# Altium schematic sheet TH2.SchDoc
size Letter; SheetNumber: 3; SheetTotal: 6
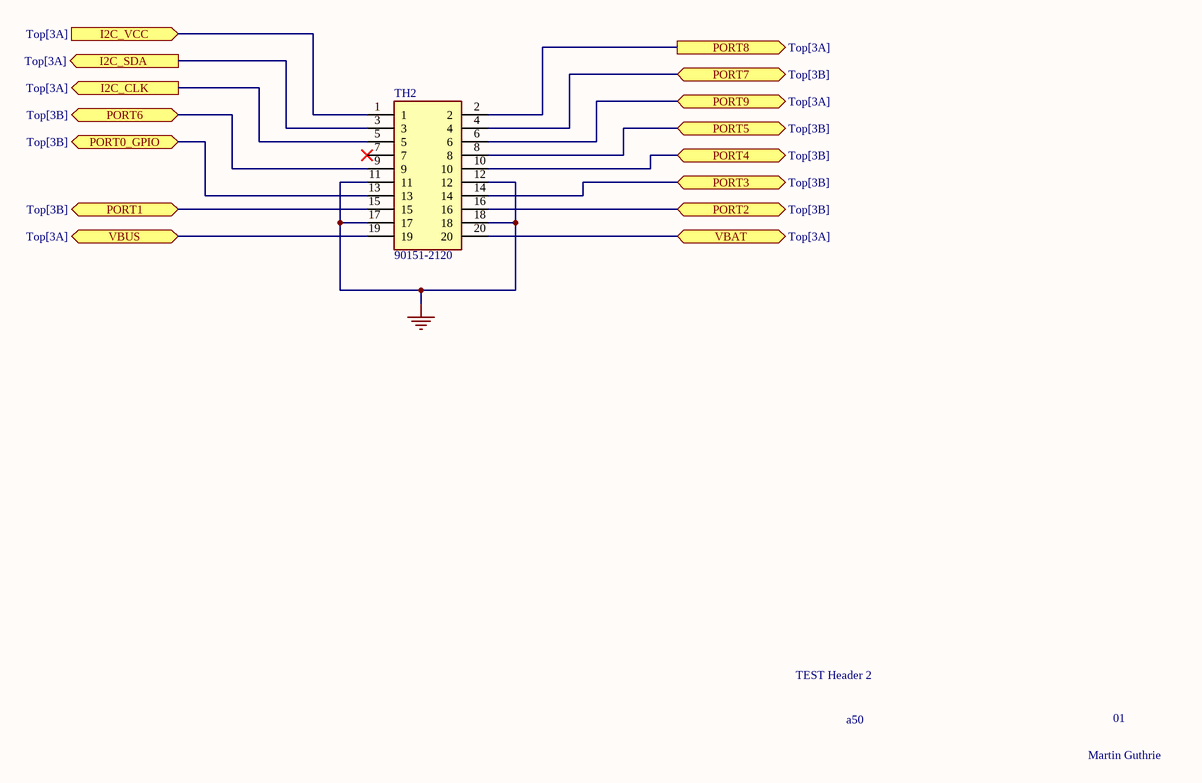
[diagram p0: TH2.SchDoc]

## Parts
TH2  90151-2120  [90151-2120]

## Ports
I2C_CLK (out, see Top[3A]), I2C_SDA (out, see Top[3A]), I2C_VCC (in, see Top[3A]), PORT0_GPIO (bidir, see Top[3B]), PORT1 (bidir, see Top[3B]), PORT2 (bidir, see Top[3B]), PORT3 (bidir, see Top[3B]), PORT4 (bidir, see Top[3B]), PORT5 (bidir, see Top[3B]), PORT6 (bidir, see Top[3B]), PORT7 (bidir, see Top[3B]), PORT8 (out, see Top[3A]), PORT9 (bidir, see Top[3A]), VBAT (bidir, see Top[3A]), VBUS (bidir, see Top[3A])

## Nets
GND: TH2.11 TH2.12 TH2.17 TH2.18
I2C_CLK: TH2.5 ; port I2C_CLK
I2C_SDA: TH2.3 ; port I2C_SDA
I2C_VCC: TH2.1 ; port I2C_VCC
PORT0_GPIO: TH2.13 ; port PORT0_GPIO
PORT1: TH2.15 ; port PORT1
PORT2: TH2.16 ; port PORT2
PORT3: TH2.14 ; port PORT3
PORT4: TH2.10 ; port PORT4
PORT5: TH2.8 ; port PORT5
PORT6: TH2.9 ; port PORT6
PORT7: TH2.4 ; port PORT7
PORT8: TH2.2 ; port PORT8
PORT9: TH2.6 ; port PORT9
VBAT: TH2.20 ; port VBAT
VBUS: TH2.19 ; port VBUS

Not connected (* = marked no-connect by the designer): TH2 7*

## Notes on the sheet
- TEST Header 2
- a50
- 01
- Martin Guthrie

## Library data of the parts
TH2 = 90151-2120: Connector; Manufacturer_Name: Molex; Datasheet Link: https://www.molex.com/pdm_docs/sd/901512120_sd.pdf; Height: 8.7mm; Manufacturer_Part_Number: 90151-2120; Mouser Part Number: 538-90151-2120; Mouser Price/Stock: https://www.mouser.co.uk/ProductDetail/Molex/90151-2120?qs=XmV31zLAuMHqFInYdcmaXg%3D%3D